# Altium schematic sheet Output_Digital.SchDoc
size A4
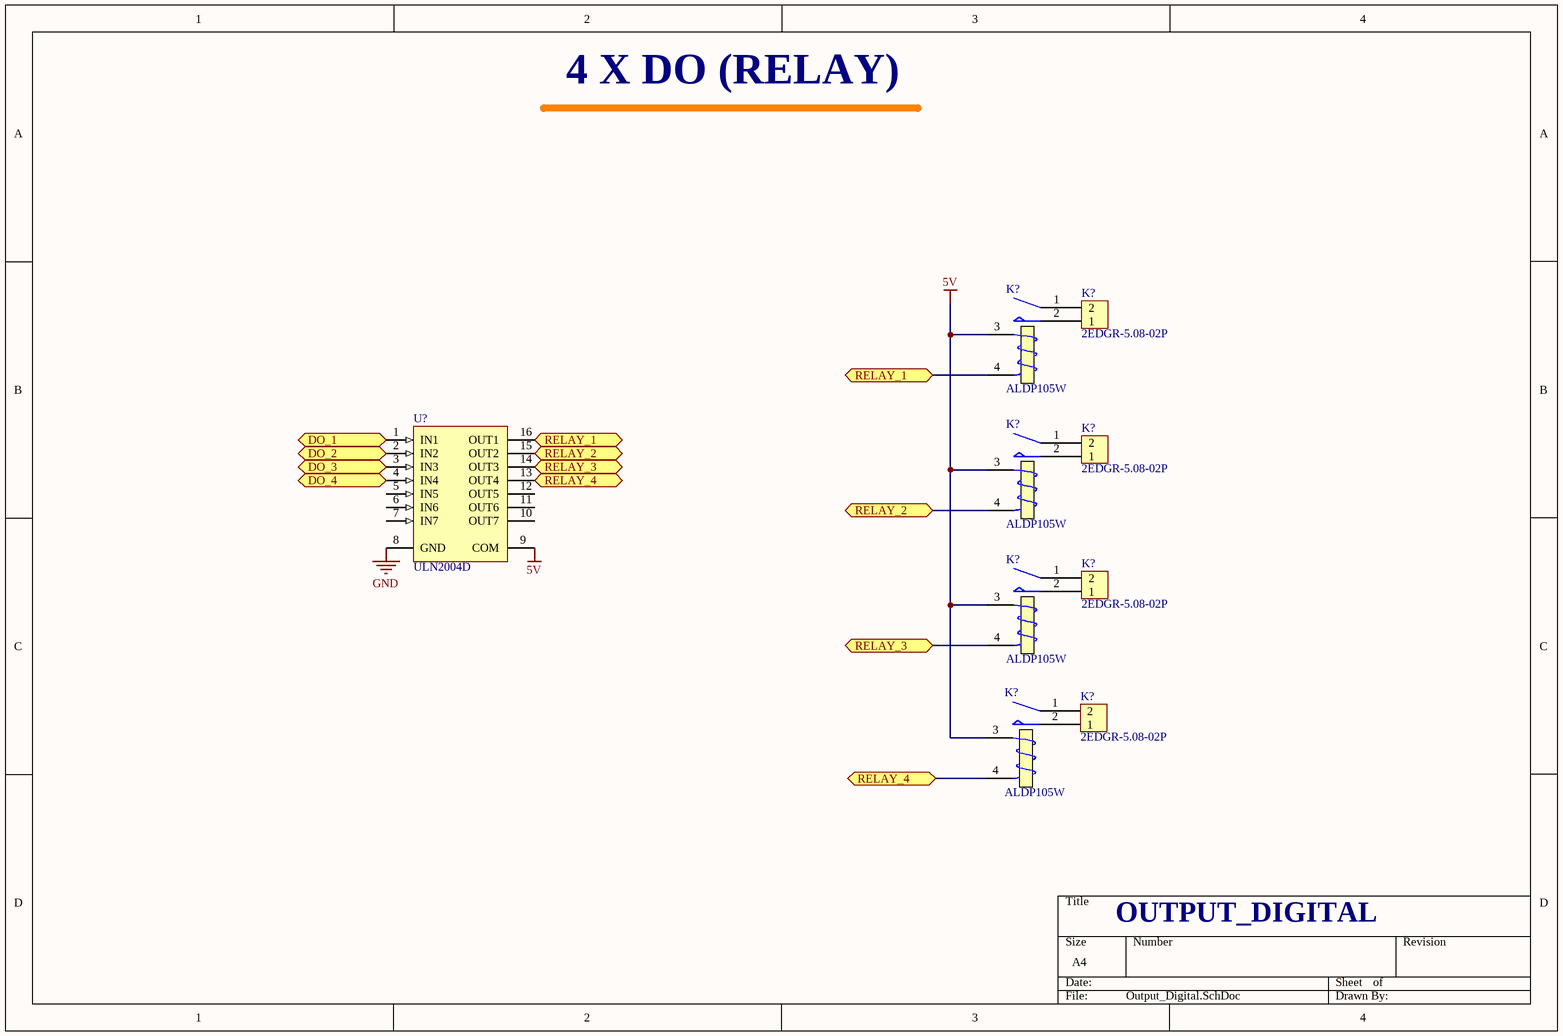
[diagram p0: Output_Digital.SchDoc]

## Parts
(Parts that share a designator on the sheet are numbered #1, #2 ... from top to bottom, then left to right.)
K?#1  ALDP105W  [RELAY_ALDP124W]
K?#2  2EDGR-5.08-02P  [CON_DG129_02P]
K?#3  ALDP105W  [RELAY_ALDP124W]
K?#4  2EDGR-5.08-02P  [CON_DG129_02P]
K?#5  ALDP105W  [RELAY_ALDP124W]
K?#6  2EDGR-5.08-02P  [CON_DG129_02P]
K?#7  ALDP105W  [RELAY_ALDP124W]
K?#8  2EDGR-5.08-02P  [CON_DG129_02P]
U?  ULN2004D  [SO16_M]

## Ports
DO_1, DO_2, DO_3, DO_4, RELAY_1, RELAY_2, RELAY_3, RELAY_4

## Nets
5V: K?#1.3(T1) K?#3.3(T1) K?#5.3(T1) K?#7.3(T1) U?.9(COM)
GND: U?.8(GND)
DO_1: U?.1(IN1) ; port DO_1
DO_2: U?.2(IN2) ; port DO_2
DO_3: U?.3(IN3) ; port DO_3
DO_4: U?.4(IN4) ; port DO_4
RELAY_1: K?#1.4(T2) U?.16(OUT1) ; port RELAY_1
RELAY_2: K?#3.4(T2) U?.15(OUT2) ; port RELAY_2
RELAY_3: K?#5.4(T2) U?.14(OUT3) ; port RELAY_3
RELAY_4: K?#7.4(T2) U?.13(OUT4) ; port RELAY_4
NetK?#1_1: K?#1.1(COM) K?#2.2
NetK?#1_2: K?#1.2(NO) K?#2.1
NetK?#3_1: K?#3.1(COM) K?#4.2
NetK?#3_2: K?#3.2(NO) K?#4.1
NetK?#5_1: K?#5.1(COM) K?#6.2
NetK?#5_2: K?#5.2(NO) K?#6.1
NetK?#7_1: K?#7.1(COM) K?#8.2
NetK?#7_2: K?#7.2(NO) K?#8.1

Not connected (* = marked no-connect by the designer): U? 5(IN5) 6(IN6) 7(IN7) 10(OUT7) 11(OUT6) 12(OUT5)

## Notes on the sheet
- 4 X DO (RELAY)
- OUTPUT_DIGITAL

## Library data of the parts
K?#1 K?#3 K?#5 K?#7 = RELAY_ALDP124W: RELAY PANASONIC ALDP105W 5A; Published: 8-Jun-2000; LatestRevisionDate: 17-Jul-2002; LatestRevisionNote: Re-released for DXP Platform.; PackageReference: MODULE5B; Publisher: Altium Limited
K?#2 K?#4 K?#6 K?#8 = KLEMENS_2P: CONNECTOR 5.08mm 2PIN 90DEG
U? = ULN2004D: IC Seven Darlington Array Integrated suppression diodes for inductive  loads; Published: 8-Jun-2000; LatestRevisionDate: 13-Apr-2006; LatestRevisionNote: IPC-7351 Footprint Added.; DatasheetVersion: Sep-1998; PackageVersion: May-1998; PackageReference: SO16; Publisher: Altium Limited; PackageDescription: 16-Pin Small Outline Integrated Circuit 1.27 mm Pitch; Code_IPC: SOIC127P600-16; ComponentLink1Description: Manufacturer Link; ComponentLink1URL: http://www.st.com/; ComponentLink2Description: Datasheet; ComponentLink2URL: http://www.st.com/stonline/products/literature/ds/5279/uln2001.pdf